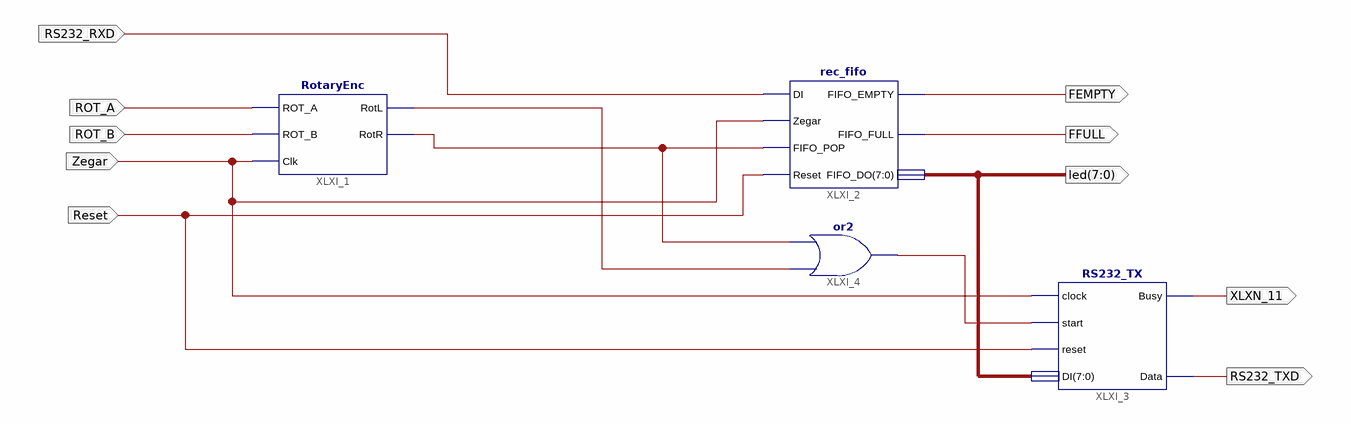
[diagram p0: schematic sheet 1]
// Xilinx ISE schematic rec_fifo_schemat.sch (spartan3e) as structural Verilog: 4 symbols, 10 ports
module rec_fifo_schemat (
  input  ROT_A,
  input  ROT_B,
  input  Zegar,
  input  RS232_RXD,
  input  Reset,
  output FEMPTY,
  output FFULL,
  output [7:0] led,
  output XLXN_11,
  output RS232_TXD
);

  wire XLXN_21, XLXN_24, XLXN_25;

  RotaryEnc XLXI_1 (.ROT_A(ROT_A), .ROT_B(ROT_B), .RotL(XLXN_25), .RotR(XLXN_24), .Clk(Zegar));
  rec_fifo XLXI_2 (
    .DI(RS232_RXD), .Zegar(Zegar), .FIFO_POP(XLXN_24), .Reset(Reset), .FIFO_EMPTY(FEMPTY), .FIFO_FULL(FFULL),
    .FIFO_DO(led));
  RS232_TX XLXI_3 (.clock(Zegar), .start(XLXN_21), .reset(Reset), .DI(led), .Busy(XLXN_11), .Data(RS232_TXD));
  or XLXI_4 (XLXN_21, XLXN_25, XLXN_24);
endmodule
